# Altium schematic sheet pH_EZO_1.SchDoc
size A4
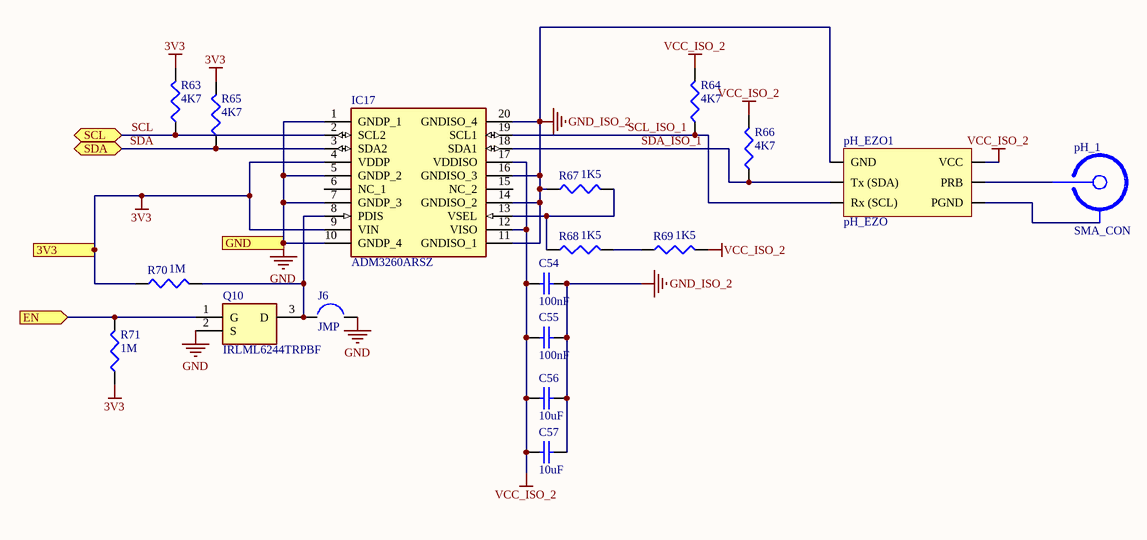
[diagram p0: pH_EZO_1.SchDoc]

## Parts
C54  100nF  [1608[0603]]
C55  100nF  [1608[0603]]
C56  10uF  [1608[0603]]
C57  10uF  [1608[0603]]
IC17  ADM3260ARSZ  [SOP65P780X200-20N]
J6  JMP  [Jumper]
pH_1  SMA_CON  [PCBSMAFRAHT]
pH_EZO1  pH_EZO  [Ph_ezo]
Q10  IRLML6244TRPBF  [SOT95P237X112-3N]
R63  4K7  [J1-0603]
R64  4K7  [J1-0603]
R65  4K7  [J1-0603]
R66  4K7  [J1-0603]
R67  1K5  [J1-0603]
R68  1K5  [J1-0603]
R69  1K5  [J1-0603]
R70  1M  [J1-0603]
R71  1M  [J1-0603]

## Ports
3V3, EN (in), GND, SCL (bidir), SDA (bidir)

## Nets
3V3: IC17.4(VDDP) IC17.9(VIN) R63.2 R65.2 R70.1 R71.1 ; port 3V3
GND: IC17.1(GNDP_1) IC17.5(GNDP_2) IC17.7(GNDP_3) IC17.10(GNDP_4) J6.2 Q10.2(S) ; port GND
GND_ISO_2: C54.2 C55.2 C56.2 C57.2 IC17.11(GNDISO_1) IC17.14(GNDISO_2) IC17.16(GNDISO_3) IC17.20(GNDISO_4) pH_EZO1.1(GND) R67.1
VCC_ISO_2: C54.1 C55.1 C56.1 C57.1 IC17.12(VISO) IC17.17(VDDISO) pH_EZO1.4(VCC) R64.2 R66.2 R69.2
EN: Q10.1(G) R71.2 ; port EN
SCL: IC17.2(SCL2) R63.1 ; port SCL
SCL_ISO_1: IC17.19(SCL1) pH_EZO1.3(Rx_(SCL)) R64.1
SDA: IC17.3(SDA2) R65.1 ; port SDA
SDA_ISO_1: IC17.18(SDA1) pH_EZO1.2(Tx_(SDA)) R66.1
NetIC17_8: IC17.8(PDIS) J6.1 Q10.3(D) R70.2
NetIC17_13: IC17.13(VSEL) R67.2 R68.1
NetpH_1_1: pH_1.1 pH_EZO1.5(PRB)
NetpH_1_2: pH_1.2 pH_EZO1.6(PGND)
NetR68_2: R68.2 R69.1

Not connected (* = marked no-connect by the designer): IC17 6(NC_1) 15(NC_2)

## Library data of the parts
C54 C55 = Cap Semi: Capacitor (Semiconductor SIM Model); Published: 8-Jun-2000; LatestRevisionDate: 29-May-2009; LatestRevisionNote: IPC-7351 Footprint Added.; PackageReference: C1206; Publisher: Altium Limited; PackageDescription: Chip Capacitor; Value: 100nF
C56 C57 = Cap Semi: Capacitor (Semiconductor SIM Model); Value: 100nF; Published: 8-Jun-2000; LatestRevisionDate: 29-May-2009; LatestRevisionNote: IPC-7351 Footprint Added.; PackageReference: C1206; Publisher: Altium Limited; PackageDescription: Chip Capacitor
IC17 = ADM3260ARSZ: Integrated Circuit; Manufacturer_Name: Analog Devices; Datasheet Link: http://www.farnell.com/datasheets/2037088.pdf; Height: 2mm; Manufacturer_Part_Number: ADM3260ARSZ; Mouser Part Number: 584-ADM3260ARSZ; Mouser Price/Stock: https://www.mouser.com/Search/Refine.aspx?Keyword=584-ADM3260ARSZ; RS Part Number: 8319113P; RS Price/Stock: http://uk.rs-online.com/web/p/products/8319113P
pH_1 = SMA: Connector; Manufacturer_Name: Taoglas; Manufacturer_Part_Number: PCB.SMAFRA.HT; Datasheet Link: https://www.mouser.com/datasheet/2/398/PCB.SMAFRA.HT_-1220750.pdf; Height: 9mm; Mouser Part Number: 960-PCB.SMAFRA.HT; Mouser Price/Stock: https://www.mouser.co.uk/ProductDetail/Taoglas/PCBSMAFRAHT?qs=RuW%2Fu%252BNMQmubIFYcN8w5Dw%3D%3D
Q10 = IRLML6244TRPBF: Transistor; Manufacturer_Name: Infineon; Allied_Number: 70411468; Datasheet Link: http://www.infineon.com/dgdl/irlml6244pbf.pdf?fileId=5546d462533600a4015356686fed261f; Height: 1.12mm; Manufacturer_Part_Number: IRLML6244TRPBF; Mouser Part Number: 942-IRLML6244TRPBF; Mouser Price/Stock: https://www.mouser.com/Search/Refine.aspx?Keyword=942-IRLML6244TRPBF; RS Part Number: 7377228P; RS Price/Stock: http://at.rs-online.com/web/p/products/7377228P; Allied Price/Stock: https://www.alliedelec.com/infineon-irlml6244trpbf/70411468/
R63-R71 = Res3: Resistor; Published: 8-Jun-2000; LatestRevisionDate: 29-May-2009; LatestRevisionNote: IPC-7351 Footprint Added.; PackageReference: J1-0603; Publisher: Altium Limited; PackageDescription: Chip Resistor
  R63-R66: Value: 4K7
  R67-R69: Value: 1K5
  R70 R71: Value: 1M